# EAGLE design AmbaSat-07-CCS811 (EAGLE 9.3.2)
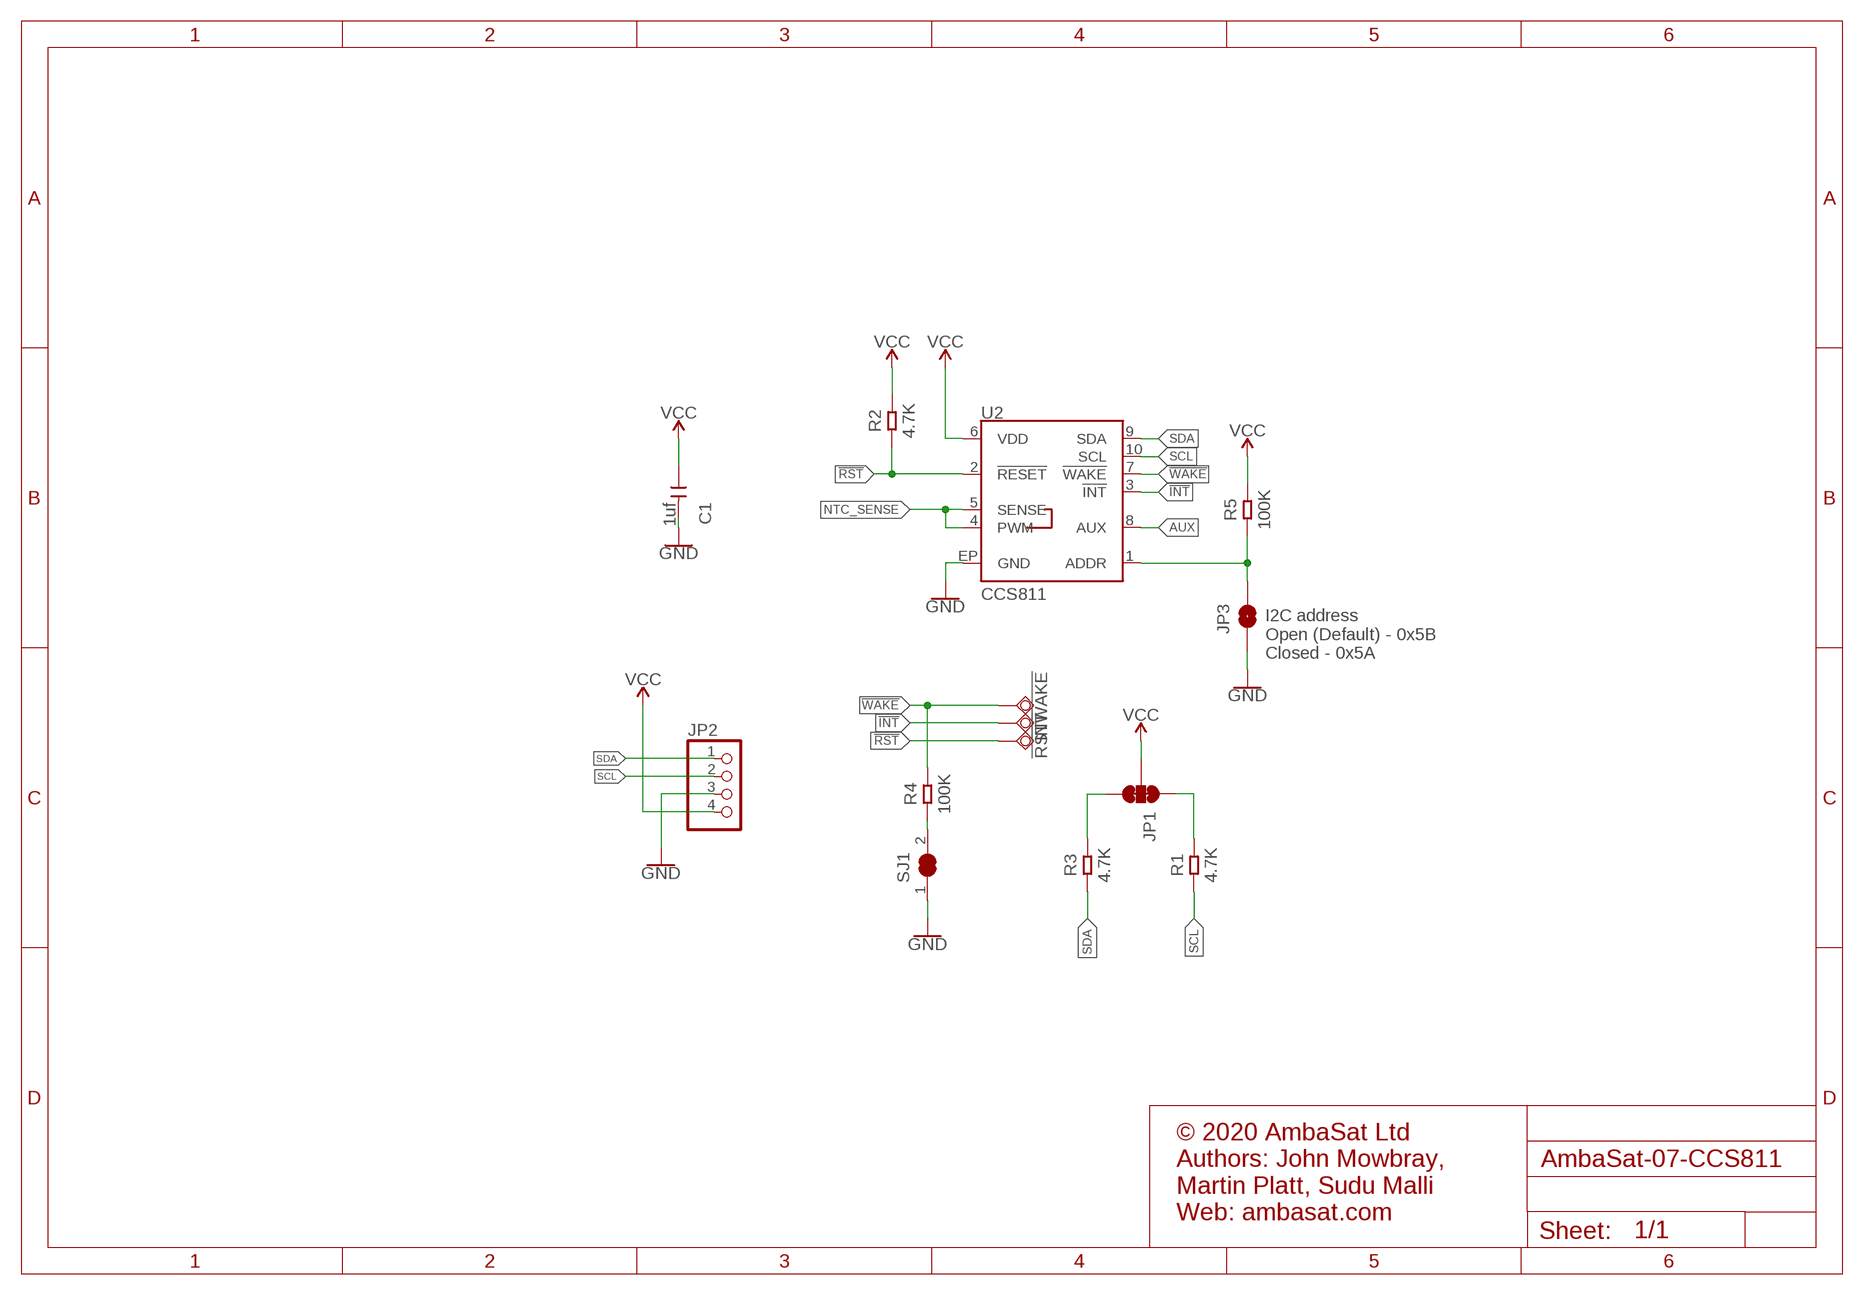
[diagram p0: schematic, sheet 1]

## Parts
!INT  TESTPAD_TPSQTP14SQ  [TESTPAD_TP14SQ]
!RST  TESTPAD_TPSQTP14SQ  [TESTPAD_TP14SQ]
!WAKE  TESTPAD_TPSQTP14SQ  [TESTPAD_TP14SQ]
C1  1uf  CERAMIC-1UF-25V-10%-X7R(0805)  [C0805]
JP1  JUMPER-SMT_3_2-NC_TRACE_SILK  [SMT-JUMPER_3_2-NC_TRACE_SILK]
JP2  HEADER-1X4  [1X04_OVAL]
JP3  JUMPER-SMT_2_NO_SILK  [SMT-JUMPER_2_NO_SILK]
R1  4.7K  SMD-RES-4.7K-5%-1/8W(0805)  [R0805]
R2  4.7K  SMD-RES-4.7K-5%-1/8W(0805)  [R0805]
R3  4.7K  SMD-RES-4.7K-5%-1/8W(0805)  [R0805]
R4  100K  SMD-RES-10K-1%-1/8W(0805)  [R0805]
R5  100K  SMD-RES-10K-1%-1/8W(0805)  [R0805]
SJ1  SOLDERJUMPER_CLOSED  [SOLDERJUMPER_CLOSEDWIRE]
U2  CCS811  [LGA10]

## Nets
3.3V [power]: C1.1 JP1.2 JP2.4 R2.2 R5.2 U2.6(VDD) ; supply symbol labelled VCC
!INT: !INT.TP U2.3(!INT!)
!RST: !RST.TP R2.1 U2.2(!RESET!)
!WAKE: !WAKE.TP R4.2 U2.7(!WAKE!)
AUX: U2.8(AUX)
CCS811_ADDR: JP3.2 R5.1 U2.1(ADDR)
GND [power]: C1.2 JP2.3 JP3.1 SJ1.1 U2.EP(GND)
N$1: R4.1 SJ1.2
N$4: JP1.3 R3.2
N$5: JP1.1 R1.2
NTC_SENSE: U2.4(PWM) U2.5(SENSE)
SCL: JP2.2 R1.1 U2.10(SCL)
SDA: JP2.1 R3.1 U2.9(SDA)

## Notes on the sheet
- I2C address
  Open (Default) - 0x5B
  Closed - 0x5A
- © 2020 AmbaSat Ltd
  Authors: John Mowbray, 
  Martin Platt, Sudu Malli
  Web: ambasat.com

## Library data of the parts
!INT !RST !WAKE = BeagleBone_Blue_R3:TESTPAD_TPSQ: Test pad
C1 = Seeed-Capacitor:CERAMIC-1UF-25V-10%-X7R(0805): 302010179; MPN: CC0805KKX7R8BB105
JP1 = SparkFun-Jumpers:JUMPER-SMT_3_2-NC_TRACE: Normally closed trace jumper (2 of 2 connections) This jumper has a trace between all three pads so they are normally closed (NC). Use a razor knife to open the connection(s). For best results follow the IPC guidelines for cutting traces: Cutout at least 0.063 mm (0.005 in). Remove all loose material to clean up the cut area. Seal the cut with an approved epoxy. Reapply solder to reclose the connection(s).
JP2 = microbuilder:HEADER-1X4: PIN HEADER
JP3 = SparkFun-Jumpers:JUMPER-SMT_2_NO: Normally open jumper This jumper has two pads in close proximity to each other. Apply solder to close the connection. Round pads are easier to solder for beginners, but are a lot larger. SparkFun Product that uses the round pads: SparkFun EL Sequencer <https://www.sparkfun.com/products/12781>
R1-R3 = Seeed-Resistor:SMD-RES-4.7K-5%-1/8W(0805): 301010306; MPN: RC0805JR-074K7L
R4 R5 = Seeed-Resistor:SMD-RES-10K-1%-1/8W(0805): 301010361; MPN: RC0805FR-0710KL; VALUE: 10K
SJ1 = microbuilder:SOLDERJUMPER_CLOSED: Solder Jumper - Closed These solder jumpers are closed by default CLOSEDWIRE - 10 mil trace between pads that can be cut and resoldered later CLOSEDPERM - 63 mil trace between pads for a permanent connection (used to 'bridge' two signals, a shameless hack for Eagle). Can double as a test point as well (no cream layer)
U2 = CCS811_Breakout_Temp:CCS811: AMS CCS811 – I2C Digital Gas Sensor Ultra-Low Power Digital Gas Sensor for Monitoring Indoor Air Quality AMS Product Page <http://ams.com/eng/Products/Environmental-Sensors/Gas-Sensors/CCS811> SparkFun Products:; PROD_ID: IC-13607

## Net classes
1 power: width 0.152 mm, drill 0.254 mm, clearance 0.152 mm

## Board
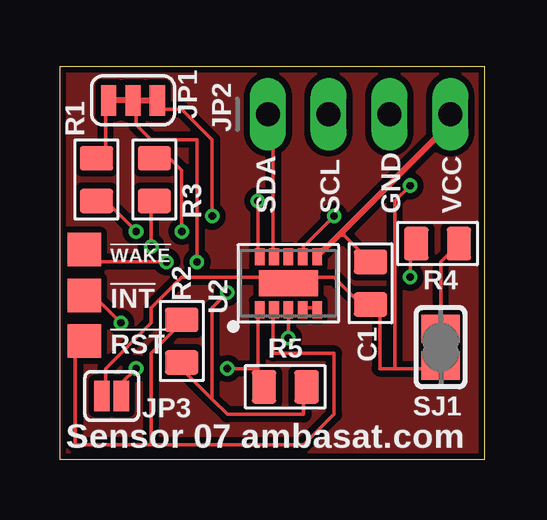
[diagram p1: board, top side]
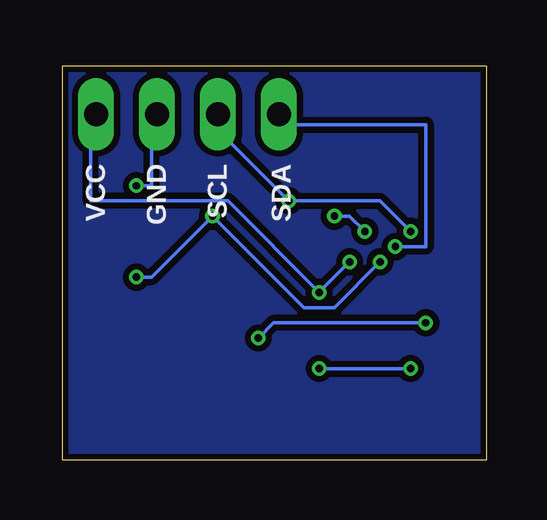
[diagram p2: board, bottom side, seen from below]

Size 17.7 x 16.4 mm. Coordinates in mm from the lower left corner, seen from the top.
Outline: 0,16.4 17.7,16.4 17.7,0 0,0 0,16.4
Copper layers (1*16): Top 0.035mm / dielectric 1.5mm / Bottom 0.035mm
Design rules "SeeedStudio_2layer_DRU_no_angle_20140221": minimum track width 6mil, minimum drill 12mil, track to track 6mil, track to pad 6mil, pad to pad 6mil, via to via 6mil, smd to smd 0mil, copper to edge 10mil, drill to drill 10mil, minimum pad ring 10mil, minimum via ring 6mil, stop-mask expansion 2mil, vias tented up to drill 100mil, thermal gap 10mil

### Footprints (pad centres in the part's own frame; a part is rotated, then mirrored left to right if it is on the bottom)
TESTPAD_TP14SQ = smd 1.4 x 1.4: TP 0,0
C0805 = smd 1.397 x 1.016: 1 0,0.889; 2 0,-0.889
SMT-JUMPER_3_2-NC_TRACE_SILK = smd 0.635 x 1.27: 1 -1.016,0; 2 0,0; 3 1.016,0
1X04_OVAL = drill 1 long: 1 -3.81,0; 2 -1.27,0; 3 1.27,0; 4 3.81,0
SMT-JUMPER_2_NO_SILK = smd 0.635 x 1.27: 1 -0.406,0; 2 0.406,0
R0805 = smd 1.397 x 1.016: 1 0,0.889; 2 0,-0.889
SOLDERJUMPER_CLOSEDWIRE = smd 1.168 x 1.6: 1 -0.762,0; 2 0.762,0 | smd 0.635 x 0.203: WIRE 0,0
LGA10 = smd 0.7 x 0.4: 1 -1.1,1.2; 2 -1.1,0.6; 3 -1.1,0; 4 -1.1,-0.6; 5 -1.1,-1.2; 6 1.1,-1.2; 7 1.1,-0.6; 8 1.1,0; 9 1.1,0.6; 10 1.1,1.2 | smd 1.1 x 2.45: EP 0,0

### Placement (x,y rotation side)
!INT  1.02,6.86 0 top
!RST  1.02,4.95 0 top
!WAKE  1.02,8.76 0 top
C1  12.95,7.37 0 top
JP1  3.05,14.99 0 top
JP2  12.48,14.4 0 top
JP3  2.16,2.67 0 top
R1  1.52,11.68 180 top
R2  5.08,4.95 0 top
R3  3.94,11.68 180 top
R4  15.75,9.02 270 top
R5  9.4,3.05 90 top
SJ1  15.88,4.7 90 top
U2  9.53,7.37 90 top

### Tracks (layer width: path | path; a pad name or v marks a point on that pad's centre or on a via)
3.3V  (via drill 0.3)
  Top 0.152: C1.1 11.8,9.41 | 6.35,2.54 6.99,1.91 10.16,1.91 10.16,2.54 R5.2 | 6.35,2.54 5.08,3.81 R2.2 | v5.71,8.26 5.71,13.34 3.81,13.34 3.17,13.97 3.17,14.61 JP1.2 | v6.99,6.99 6.35,6.35 6.35,2.54
  Top 0.254: U2.6 11.67,9.41 | 11.67,9.41 16.29,14.03 JP2.4 | 11.8,9.41 11.67,9.41
  Bottom 0.152: v5.71,8.26 v6.99,6.99 10.79,10.79 16.51,10.79 16.51,13.97 JP2.4
!INT  (via drill 0.3)
  Top 0.152: v9.53,5.08 U2.3 | v2.54,5.71 1.27,6.99 !INT.TP
  Bottom 0.152: v9.53,5.08 8.89,5.71 v2.54,5.71
!RST
  Top 0.152: 3.81,0.64 0.64,0.64 0.64,4.45 !RST.TP | 3.81,0.64 10.16,0.64 11.43,1.91 11.43,4.45 8.89,4.45 8.89,6.35 U2.2 | 3.81,0.64 3.81,4.45 5.08,5.71 R2.1
!WAKE  (via drill 0.3)
  Top 0.152: v11.43,10.16 10.16,8.89 10.16,8.26 U2.7 | v14.61,7.62 14.61,8.89 R4.2 | v4.45,8.26 1.27,8.26 !WAKE.TP
  Bottom 0.152: v14.61,7.62 13.97,7.62 v11.43,10.16 7.62,6.35 6.35,6.35 v4.45,8.26
CCS811_ADDR  (via drill 0.3)
  Top 0.152: 8.26,3.81 8.26,3.17 R5.1 | 8.26,3.81 8.26,6.35 U2.1 | v3.17,3.81 2.54,3.17 JP3.2 | 8.26,3.81 v6.99,3.81
  Bottom 0.152: v6.99,3.81 v3.17,3.81
GND  (via drill 0.3)
  Top 0.152: 9.53,7.62 5.08,7.62 3.81,6.35 3.81,5.71 1.91,3.81 1.91,3.17 JP3.1 | 9.53,7.62 11.43,7.62 12.7,6.35 C1.2 13.34,6.35 13.34,3.81 13.97,3.81 | 9.53,7.62 U2.EP | 13.97,3.81 15.88,3.81 SJ1.1 | v14.61,11.43 13.97,10.79 13.97,3.81
  Bottom 0.152: v14.61,11.43 13.97,11.43 13.97,13.97 JP2.3
GND_X1
  pour Bottom (isolate 0.254): 0,16.51 17.78,16.51 17.78,0 0,0
GND_X2
  pour Top (isolate 0.254): 0,16.51 17.78,16.51 17.78,0 0,0
N$1
  Top 0.152: R4.1 15.88,8.26 SJ1.2
N$4  (via drill 0.3)
  Top 0.152: v5.08,9.53 5.08,12.06 4.45,12.7 R3.2 | v6.35,10.16 6.35,13.34 5.08,14.61 3.81,14.61 JP1.3
  Bottom 0.152: v5.08,9.53 5.71,10.16 v6.35,10.16
N$5
  Top 0.152: JP1.1 1.91,14.61 1.91,12.7 R1.2
NTC_SENSE
  Top 0.152: U2.4 10.16,6.35 10.79,6.35 U2.5
SCL  (via drill 0.3)
  Top 0.152: v8.26,10.79 8.26,8.26 U2.10 | v3.17,9.53 1.91,10.79 R1.1
  Bottom 0.152: JP2.2 11.43,13.97 v8.26,10.79 4.45,10.79 v3.17,9.53
SDA  (via drill 0.3)
  Top 0.152: U2.9 8.89,8.26 8.89,13.97 JP2.1 | v3.81,8.89 3.81,10.79 R3.1
  Bottom 0.152: v3.81,8.89 2.54,8.89 2.54,13.97 8.26,13.97 JP2.1

### Text on the board
tPlace: SDA | SCL | GND | VCC | Sensor 07 ambasat.com
bPlace: SDA | SCL | GND | VCC